# Altium schematic sheet SatBusConnections.SchDoc: SunS - PW-Sat2 connections
size A4; Author: Michał Gumiela; DocumentNumber: 16; SheetNumber: 16; SheetTotal: 16; Model: EM1; PageSetup: Record=PageOptions|CenterHorizontal=True|CenterVertical=True|PrintScale=0.52|XCorrection=1.00|YCorrection=1.00|PrintKind=1|BorderSize=5000000|LeftOffset=0|BottomOffset=0|Orientation=2|PaperLength=4200|PaperWidth=2970|Scale=100|PaperSource=7|PrintQuality=600|MediaType=1|DitherType=10|PaperKind=A3|PrintScaleMode=1
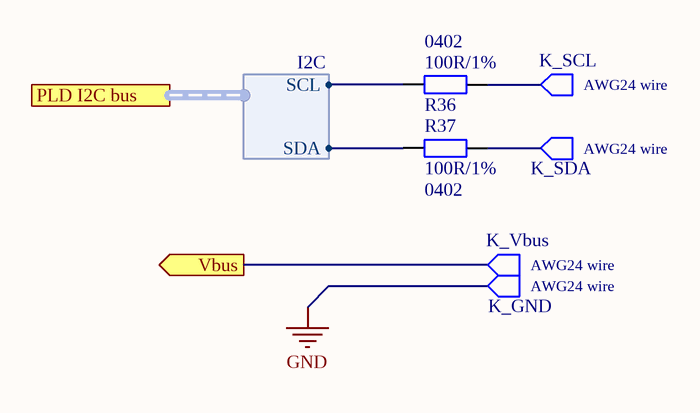
[diagram p0: SatBusConnections.SchDoc]

## Parts
K_GND  AWG24 wire  [wire-awg26-1_stress-relief]
K_SCL  AWG24 wire  [wire-awg26-1_stress-relief]
K_SDA  AWG24 wire  [wire-awg26-1_stress-relief]
K_Vbus  AWG24 wire  [wire-awg26-1_stress-relief]
R36  Package: 0402  [SMD_Resistor_0402]  (hidden comment: 100R/1%)
R37  Package: 0402  [SMD_Resistor_0402]  (hidden comment: 100R/1%)

## Ports
PLD I2C bus (harness I2C), Vbus (out)

## Harnesses
I2C: SCL, SDA

## Nets
GND: K_GND.1
Vbus: K_Vbus.1 ; port Vbus
NetK_SCL_1: K_SCL.1 R36.2
NetK_SDA_1: K_SDA.1 R37.2
NetR36_1: R36.1 ; port PLD I2C bus.SCL
NetR37_1: R37.1 ; port PLD I2C bus.SDA

## Notes on the sheet
- Title:
- Sheet:
- of
- Author:
- Model:
- Document Number:
- Checked by:
- Iss-Rev:
- Approved by:
- Date:
- File name:

## Library data of the parts
K_GND K_SCL K_SDA K_Vbus = wire-awg26-1: Single wire AWG26 solder point.; Value: AWG24 wire
R36 R37 = CRCW0402100RFKxxxx: 100R/1% Vishay CRCW 0402 Resistor. 63mW, 100ppm, 50V.; Manufacturer: Vishay; ManufacturerPartNumber: CRCW0402100RFKxxxx; Value: 100R/1%